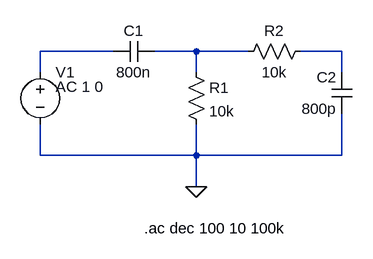
[diagram p0: schematic RC_bandpass.asc]
RC_bandpass.asc, the LTspice schematic file:
Version 4
SHEET 1 880 680
WIRE 272 224 160 224
WIRE 400 224 336 224
WIRE 480 224 400 224
WIRE 624 224 560 224
WIRE 160 256 160 224
WIRE 400 256 400 224
WIRE 624 256 624 224
WIRE 160 384 160 336
WIRE 400 384 400 336
WIRE 400 384 160 384
WIRE 624 384 624 320
WIRE 624 384 400 384
WIRE 400 432 400 384
FLAG 400 432 0
SYMBOL Voltage 160 240 R0
WINDOW 123 24 38 Left 2
SYMATTR InstName V1
SYMATTR Value ""
SYMATTR Value2 AC 1 0
SYMBOL Cap 336 208 R90
WINDOW 0 0 32 VBottom 2
WINDOW 3 32 32 VTop 2
SYMATTR InstName C1
SYMATTR Value 800n
SYMBOL Res 384 240 R0
SYMATTR InstName R1
SYMATTR Value 10k
SYMBOL Cap 640 320 R180
WINDOW 0 24 56 Left 2
WINDOW 3 24 8 Left 2
SYMATTR InstName C2
SYMATTR Value 800p
SYMBOL Res 576 208 R90
WINDOW 0 0 56 VBottom 2
WINDOW 3 32 56 VTop 2
SYMATTR InstName R2
SYMATTR Value 10k
TEXT 320 496 Left 2 !.ac dec 100 10 100k

The netlist it stands for:
* RC_bandpass.asc
V1 N001 0 AC 1 0
C1 N002 N001 800n
R1 N002 0 10k
C2 0 N003 800p
R2 N003 N002 10k
.ac dec 100 10 100k
.backanno
.end